# EAGLE schematic 16 seg display board (EAGLE 9.3.1)
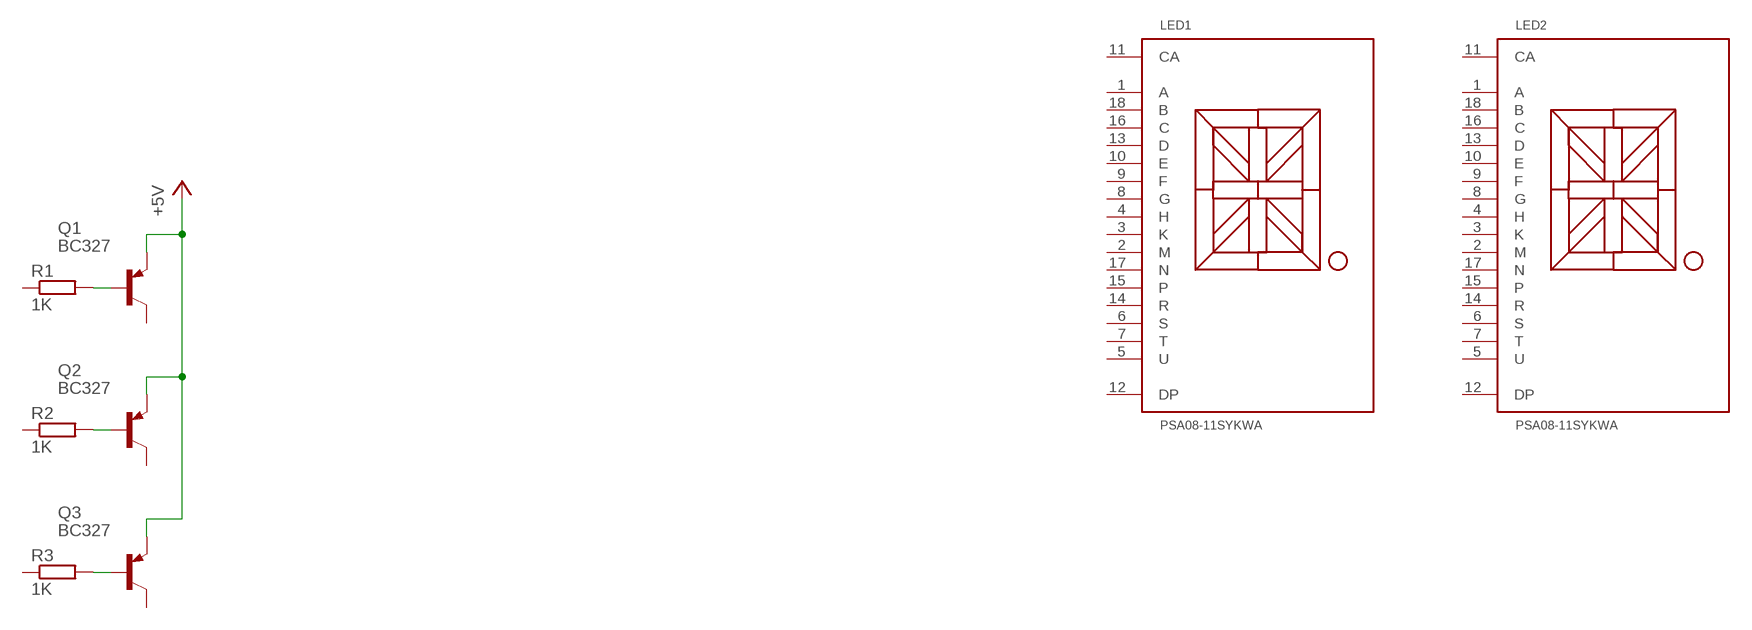
[diagram p0: schematic, sheet 1, part 1 of 2]
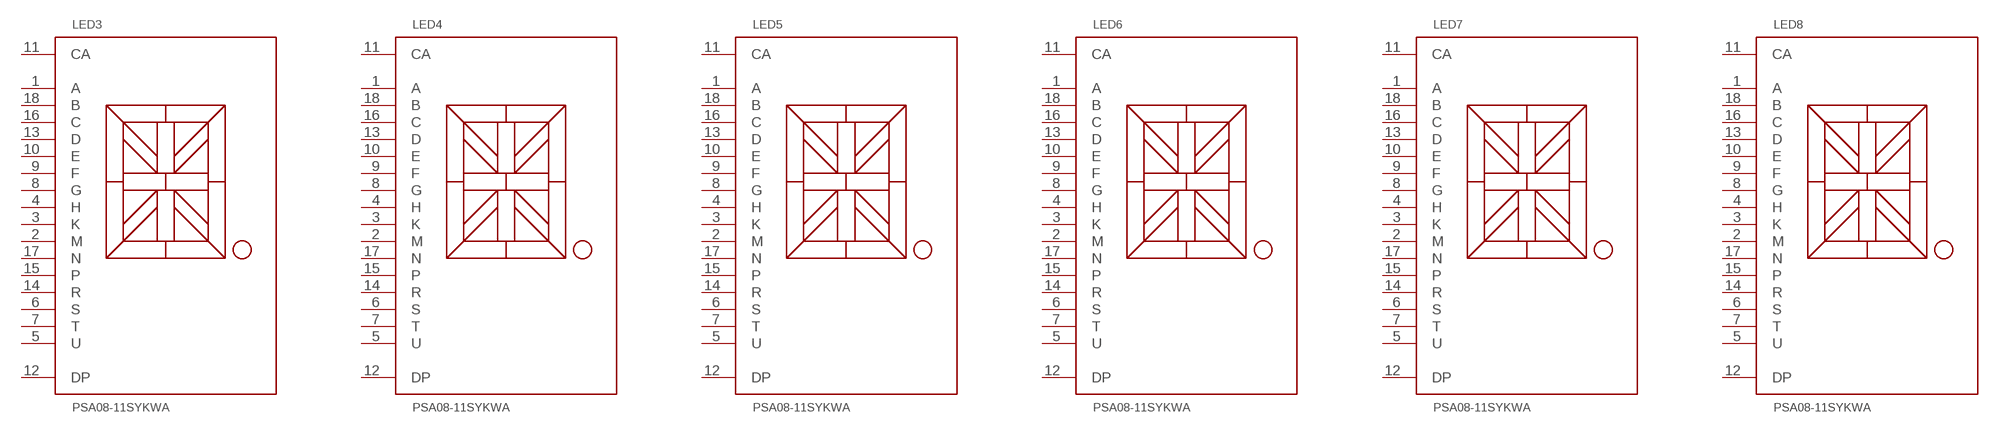
[diagram p1: schematic, sheet 1, part 2 of 2]

## Parts
LED1  PSA08-11SYKWA  [PSA08-11SYKWA]
LED2  PSA08-11SYKWA  [PSA08-11SYKWA]
LED3  PSA08-11SYKWA  [PSA08-11SYKWA]
LED4  PSA08-11SYKWA  [PSA08-11SYKWA]
LED5  PSA08-11SYKWA  [PSA08-11SYKWA]
LED6  PSA08-11SYKWA  [PSA08-11SYKWA]
LED7  PSA08-11SYKWA  [PSA08-11SYKWA]
LED8  PSA08-11SYKWA  [PSA08-11SYKWA]
Q1  BC327  [TO92-EBC]
Q2  BC327  [TO92-EBC]
Q3  BC327  [TO92-EBC]
R1  1K  R-EU_0207/10  [0207/10]
R2  1K  R-EU_0207/10  [0207/10]
R3  1K  R-EU_0207/10  [0207/10]

## Nets
+5V: Q1.E Q2.E Q3.E
N$1: Q1.B R1.2
N$2: Q2.B R2.2
N$3: Q3.B R3.2
Unconnected: LED1.1(A) LED1.2(M) LED1.3(K) LED1.4(H) LED1.5(U) LED1.6(S) LED1.7(T) LED1.8(G) LED1.9(F) LED1.10(E) LED1.12(DP) LED1.13(D) LED1.14(R) LED1.15(P) LED1.16(C) LED1.17(N) LED1.18(B) LED2.1(A) LED2.2(M) LED2.3(K) LED2.4(H) LED2.5(U) LED2.6(S) LED2.7(T) LED2.8(G) LED2.9(F) LED2.10(E) LED2.12(DP) LED2.13(D) LED2.14(R) LED2.15(P) LED2.16(C) LED2.17(N) LED2.18(B) LED3.1(A) LED3.2(M) LED3.3(K) LED3.4(H) LED3.5(U) LED3.6(S) LED3.7(T) LED3.8(G) LED3.9(F) LED3.10(E) LED3.12(DP) LED3.13(D) LED3.14(R) LED3.15(P) LED3.16(C) LED3.17(N) LED3.18(B) LED4.1(A) LED4.2(M) LED4.3(K) LED4.4(H) LED4.5(U) LED4.6(S) LED4.7(T) LED4.8(G) LED4.9(F) LED4.10(E) LED4.12(DP) LED4.13(D) LED4.14(R) LED4.15(P) LED4.16(C) LED4.17(N) LED4.18(B) LED5.1(A) LED5.2(M) LED5.3(K) LED5.4(H) LED5.5(U) LED5.6(S) LED5.7(T) LED5.8(G) LED5.9(F) LED5.10(E) LED5.12(DP) LED5.13(D) LED5.14(R) LED5.15(P) LED5.16(C) LED5.17(N) LED5.18(B) LED6.1(A) LED6.2(M) LED6.3(K) LED6.4(H) LED6.5(U) LED6.6(S) LED6.7(T) LED6.8(G) LED6.9(F) LED6.10(E) LED6.12(DP) LED6.13(D) LED6.14(R) LED6.15(P) LED6.16(C) LED6.17(N) LED6.18(B) LED7.1(A) LED7.2(M) LED7.3(K) LED7.4(H) LED7.5(U) LED7.6(S) LED7.7(T) LED7.8(G) LED7.9(F) LED7.10(E) LED7.12(DP) LED7.13(D) LED7.14(R) LED7.15(P) LED7.16(C) LED7.17(N) LED7.18(B) LED8.1(A) LED8.2(M) LED8.3(K) LED8.4(H) LED8.5(U) LED8.6(S) LED8.7(T) LED8.8(G) LED8.9(F) LED8.10(E) LED8.12(DP) LED8.13(D) LED8.14(R) LED8.15(P) LED8.16(C) LED8.17(N) LED8.18(B) Q1.C Q2.C Q3.C R1.1 R2.1 R3.1

## Power pins joined to a net without a drawn wire
CA: LED1.11(CA) LED2.11(CA) LED3.11(CA) LED4.11(CA) LED5.11(CA) LED6.11(CA) LED7.11(CA) LED8.11(CA)

## Library data of the parts
LED1-LED8 = Z80 clock:PSA08-11SYKWA
Q1-Q3 = transistor-pnp:BC327*: PNP Transistror
R1-R3 = rcl:R-EU_: RESISTOR, European symbol